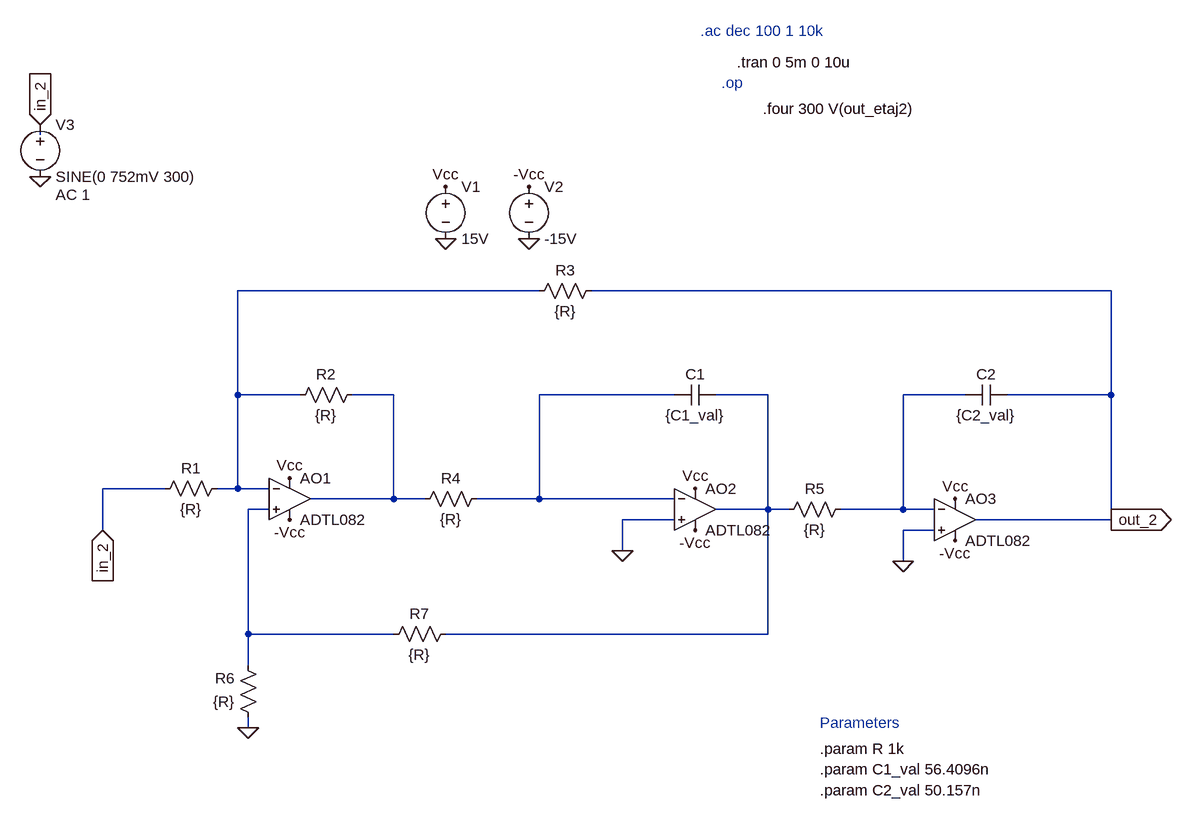
[diagram p0: schematic etaj2.asc]
etaj2.asc, the LTspice schematic file:
Version 4
SHEET 1 1516 992
WIRE -592 -32 -592 -48
WIRE 176 208 -288 208
WIRE 1056 208 256 208
WIRE -288 368 -288 208
WIRE -192 368 -288 368
WIRE -48 368 -112 368
WIRE 384 368 176 368
WIRE 528 368 448 368
WIRE 832 368 736 368
WIRE 1056 368 1056 208
WIRE 1056 368 896 368
WIRE -400 512 -496 512
WIRE -288 512 -288 368
WIRE -288 512 -320 512
WIRE -240 512 -288 512
WIRE -48 528 -48 368
WIRE -48 528 -176 528
WIRE 0 528 -48 528
WIRE 176 528 176 368
WIRE 176 528 80 528
WIRE 384 528 176 528
WIRE -240 544 -272 544
WIRE 528 544 528 368
WIRE 528 544 448 544
WIRE 560 544 528 544
WIRE 736 544 736 368
WIRE 736 544 640 544
WIRE 784 544 736 544
WIRE 384 560 304 560
WIRE 1056 560 1056 368
WIRE 1056 560 848 560
WIRE -496 576 -496 512
WIRE 784 576 736 576
WIRE 304 608 304 560
WIRE 736 624 736 576
WIRE -272 736 -272 544
WIRE -48 736 -272 736
WIRE 528 736 528 544
WIRE 528 736 32 736
WIRE -272 784 -272 736
WIRE -272 880 -272 864
FLAG 32 48 Vcc
FLAG 160 48 -Vcc
FLAG 32 128 0
FLAG 160 128 0
FLAG 1056 560 out_2
IOPIN 1056 560 Out
FLAG 736 624 0
FLAG 304 608 0
FLAG -272 880 0
FLAG -208 496 Vcc
FLAG 416 512 Vcc
FLAG 816 528 Vcc
FLAG -208 560 -Vcc
FLAG 416 576 -Vcc
FLAG 816 592 -Vcc
FLAG -592 32 0
FLAG -496 576 in_2
IOPIN -496 576 In
FLAG -592 -48 in_2
IOPIN -592 -48 In
DATAFLAG -448 512 ""
SYMBOL voltage 32 32 R0
SYMATTR InstName V1
SYMATTR Value 15V
SYMBOL voltage 160 32 R0
SYMATTR InstName V2
SYMATTR Value -15V
SYMBOL res -304 496 R90
WINDOW 0 0 56 VBottom 2
WINDOW 3 32 56 VTop 2
SYMATTR InstName R1
SYMATTR Value {R}
SYMBOL OpAmps\\ADTL082 -208 464 R0
SYMATTR InstName AO1
SYMBOL res -96 352 R90
WINDOW 0 0 56 VBottom 2
WINDOW 3 32 56 VTop 2
SYMATTR InstName R2
SYMATTR Value {R}
SYMBOL res 272 192 R90
WINDOW 0 0 56 VBottom 2
WINDOW 3 32 56 VTop 2
SYMATTR InstName R3
SYMATTR Value {R}
SYMBOL res 96 512 R90
WINDOW 0 0 56 VBottom 2
WINDOW 3 32 56 VTop 2
SYMATTR InstName R4
SYMATTR Value {R}
SYMBOL cap 448 352 R90
WINDOW 0 0 32 VBottom 2
WINDOW 3 32 32 VTop 2
SYMATTR InstName C1
SYMATTR Value {C1_val}
SYMBOL OpAmps\\ADTL082 416 480 R0
SYMATTR InstName AO2
SYMBOL OpAmps\\ADTL082 816 496 R0
SYMATTR InstName AO3
SYMBOL res 656 528 R90
WINDOW 0 0 56 VBottom 2
WINDOW 3 32 56 VTop 2
SYMATTR InstName R5
SYMATTR Value {R}
SYMBOL cap 896 352 R90
WINDOW 0 0 32 VBottom 2
WINDOW 3 32 32 VTop 2
SYMATTR InstName C2
SYMATTR Value {C2_val}
SYMBOL res -256 880 R180
WINDOW 0 36 76 Left 2
WINDOW 3 36 40 Left 2
SYMATTR InstName R6
SYMATTR Value {R}
SYMBOL res 48 720 R90
WINDOW 0 0 56 VBottom 2
WINDOW 3 32 56 VTop 2
SYMATTR InstName R7
SYMATTR Value {R}
SYMBOL voltage -592 -64 R0
WINDOW 123 24 124 Left 2
WINDOW 39 0 0 Left 0
SYMATTR Value2 AC 1
SYMATTR InstName V3
SYMATTR Value SINE(0 752mV 300)
TEXT 608 872 Left 2 ;Parameters
TEXT 608 912 Left 2 !.param R 1k
TEXT 608 944 Left 2 !.param C1_val 56.4096n
TEXT 608 976 Left 2 !.param C2_val 50.157n
TEXT 456 -112 Left 2 ;.op
TEXT 424 -192 Left 2 ;.ac dec 100 1 10k
TEXT 480 -144 Left 2 !.tran 0 5m 0 10u
TEXT 520 -72 Left 2 !.four 300 V(out_etaj2)

The netlist it stands for:
* etaj2.asc
V1 Vcc 0 15V
V2 -Vcc 0 -15V
R1 N001 in_2 {R}
XAO1 N006 N001 Vcc -Vcc N002 ADTL082  ; pins In+ In- V+ V- OUT
R2 N002 N001 {R}
R3 out_2 N001 {R}
R4 N003 N002 {R}
C1 N004 N003 {C1_val}
XAO2 0 N003 Vcc -Vcc N004 ADTL082  ; pins In+ In- V+ V- OUT
XAO3 0 N005 Vcc -Vcc out_2 ADTL082  ; pins In+ In- V+ V- OUT
R5 N005 N004 {R}
C2 out_2 N005 {C2_val}
R6 0 N006 {R}
R7 N004 N006 {R}
V3 in_2 0 SINE(0 752mV 300) AC 1
* Parameters
.param R 1k
.param C1_val 56.4096n
.param C2_val 50.157n
* .op
* .ac dec 100 1 10k
.tran 0 5m 0 10u
.four 300 V(out_etaj2)
.lib ADI.lib
.backanno
.end

* Results of the author's LTspice run, read from the files saved beside the schematic
* Operating Point, zero values left out:
*   V(vcc) = 15 V
*   V(-vcc) = -15 V
*   I(R2) = 2 pA
*   I(R4) = -2 pA
*   I(R5) = -2 pA
*   I(R7) = 2 pA
*   I(V1) = -15.37 mA
*   I(V2) = 15.37 mA
*   Ix(ao1:1) = 2 pA
*   Ix(ao1:2) = 2 pA
*   Ix(ao1:3) = 5.124 mA
*   Ix(ao1:4) = -5.124 mA
*   Ix(ao1:5) = -4 pA
*   Ix(ao2:1) = 2 pA
*   Ix(ao2:2) = 2 pA
*   Ix(ao2:3) = 5.124 mA
*   Ix(ao2:4) = -5.124 mA
*   Ix(ao2:5) = -4 pA
*   Ix(ao3:1) = 2 pA
*   Ix(ao3:2) = 2 pA
*   Ix(ao3:3) = 5.124 mA
*   Ix(ao3:4) = -5.124 mA
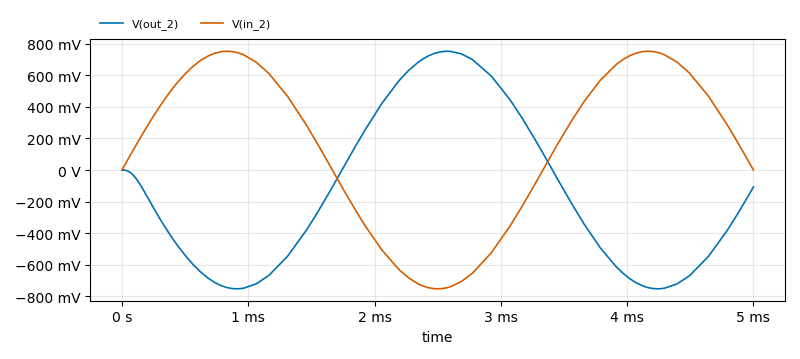
[diagram p1: Transient Analysis of etaj2.asc, plotted from the saved traces]
* Transient Analysis, 1 run:
*   V(out_2): min -751.8 mV, max 751.7 mV, average -158.4 mV, rms 531.6 mV, last -106.7 mV
*   V(in_2): min -751.3 mV, max 752 mV, average 159.3 mV, rms 532 mV, last 0 V